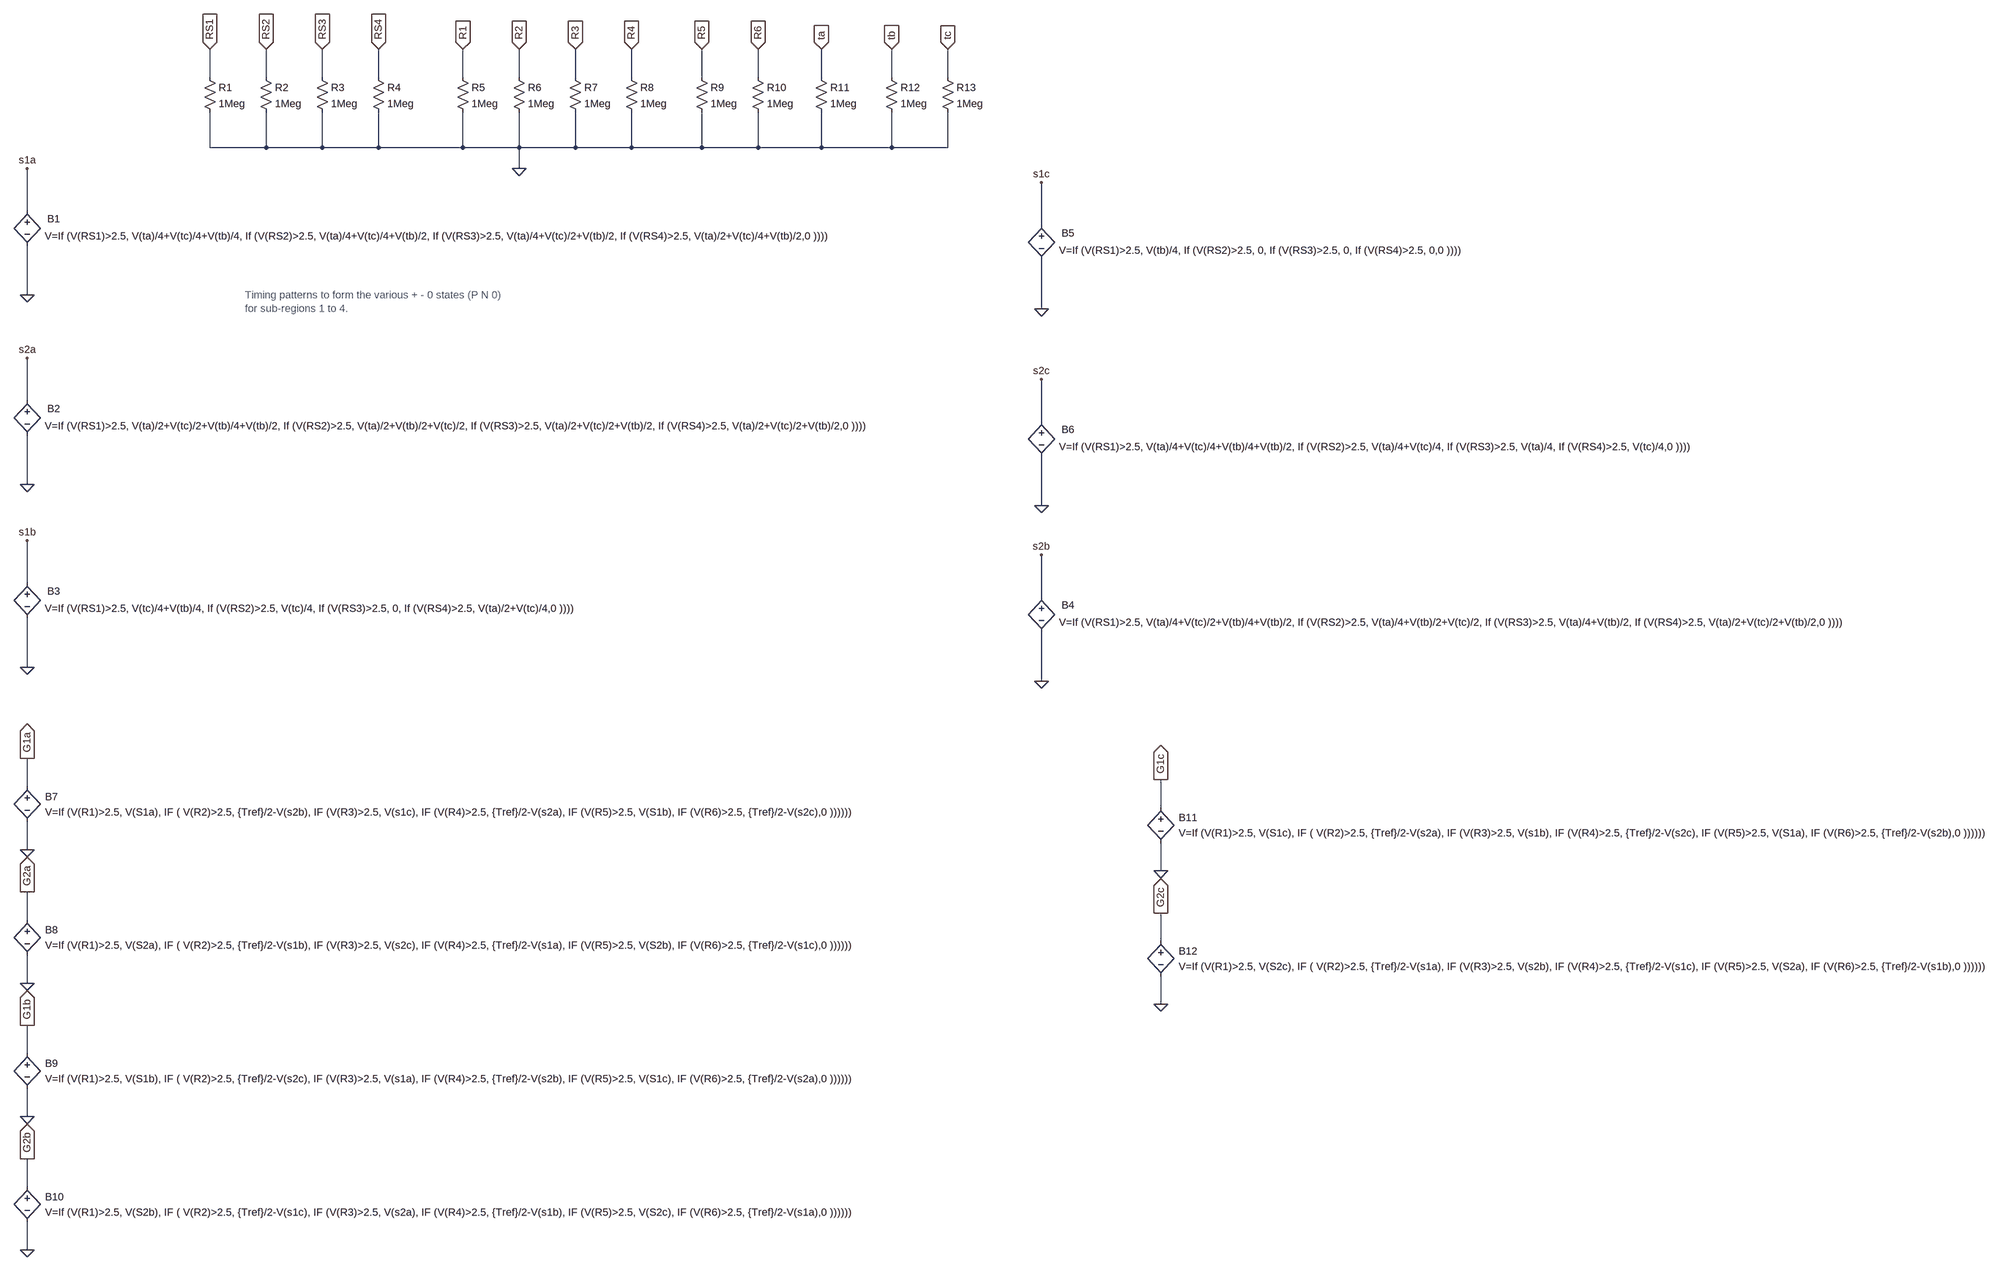
[diagram p0: schematic TimingGenerator.asc]
TimingGenerator.asc, the LTspice schematic file:
Version 4.1
SHEET 1 3956 2836
WIRE -464 -528 -464 -592
WIRE -336 -528 -336 -592
WIRE -208 -528 -208 -592
WIRE -80 -528 -80 -592
WIRE 112 -528 112 -592
WIRE 240 -528 240 -592
WIRE 368 -528 368 -592
WIRE 496 -528 496 -592
WIRE 656 -528 656 -592
WIRE 784 -528 784 -592
WIRE 928 -528 928 -592
WIRE 1088 -528 1088 -592
WIRE 1216 -528 1216 -592
WIRE -464 -368 -464 -448
WIRE -336 -368 -336 -448
WIRE -336 -368 -464 -368
WIRE -208 -368 -208 -448
WIRE -208 -368 -336 -368
WIRE -80 -368 -80 -448
WIRE -80 -368 -208 -368
WIRE 112 -368 112 -448
WIRE 112 -368 -80 -368
WIRE 240 -368 240 -448
WIRE 240 -368 112 -368
WIRE 368 -368 368 -448
WIRE 368 -368 240 -368
WIRE 496 -368 496 -448
WIRE 496 -368 368 -368
WIRE 656 -368 656 -448
WIRE 656 -368 496 -368
WIRE 784 -368 784 -448
WIRE 784 -368 656 -368
WIRE 928 -368 928 -448
WIRE 928 -368 784 -368
WIRE 1088 -368 1088 -448
WIRE 1088 -368 928 -368
WIRE 1216 -368 1216 -448
WIRE 1216 -368 1088 -368
WIRE 240 -320 240 -368
WIRE -880 -224 -880 -320
WIRE 1584 -192 1584 -288
WIRE -880 -32 -880 -144
WIRE 1584 0 1584 -112
WIRE -880 208 -880 112
WIRE 1584 256 1584 160
WIRE -880 400 -880 288
WIRE 1584 448 1584 336
WIRE -880 624 -880 528
WIRE 1584 656 1584 560
WIRE -880 816 -880 704
WIRE 1584 848 1584 736
WIRE -880 1088 -880 1024
WIRE 1856 1136 1856 1072
WIRE -880 1232 -880 1168
WIRE 1856 1280 1856 1216
WIRE -880 1392 -880 1328
WIRE 1856 1440 1856 1376
WIRE -880 1536 -880 1472
WIRE 1856 1584 1856 1520
WIRE -880 1696 -880 1632
WIRE -880 1840 -880 1776
WIRE -880 2000 -880 1936
WIRE -880 2144 -880 2080
FLAG -880 -320 s1a
FLAG -880 -32 0
FLAG -880 112 s2a
FLAG -880 400 0
FLAG -880 528 s1b
FLAG -880 816 0
FLAG 1584 560 s2b
FLAG 1584 848 0
FLAG 1584 -288 s1c
FLAG 1584 0 0
FLAG 1584 160 s2c
FLAG 1584 448 0
FLAG -880 1232 0
FLAG -880 1024 G1a
IOPIN -880 1024 Out
FLAG -880 1536 0
FLAG -880 1328 G2a
IOPIN -880 1328 Out
FLAG -880 1840 0
FLAG -880 1632 G1b
IOPIN -880 1632 Out
FLAG -880 2144 0
FLAG -880 1936 G2b
IOPIN -880 1936 Out
FLAG 1856 1280 0
FLAG 1856 1072 G1c
IOPIN 1856 1072 Out
FLAG 1856 1584 0
FLAG 1856 1376 G2c
IOPIN 1856 1376 Out
FLAG 240 -320 0
FLAG -464 -592 RS1
IOPIN -464 -592 In
FLAG -336 -592 RS2
IOPIN -336 -592 In
FLAG -208 -592 RS3
IOPIN -208 -592 In
FLAG -80 -592 RS4
IOPIN -80 -592 In
FLAG 112 -592 R1
IOPIN 112 -592 In
FLAG 240 -592 R2
IOPIN 240 -592 In
FLAG 368 -592 R3
IOPIN 368 -592 In
FLAG 496 -592 R4
IOPIN 496 -592 In
FLAG 656 -592 R5
IOPIN 656 -592 In
FLAG 784 -592 R6
IOPIN 784 -592 In
FLAG 928 -592 ta
IOPIN 928 -592 In
FLAG 1088 -592 tb
IOPIN 1088 -592 In
FLAG 1216 -592 tc
IOPIN 1216 -592 In
SYMBOL bv -880 -240 R0
WINDOW 0 46 35 Left 2
WINDOW 3 40 74 Left 2
SYMATTR InstName B1
SYMATTR Value V=If (V(RS1)>2.5, V(ta)/4+V(tc)/4+V(tb)/4, If (V(RS2)>2.5, V(ta)/4+V(tc)/4+V(tb)/2, If (V(RS3)>2.5, V(ta)/4+V(tc)/2+V(tb)/2, If (V(RS4)>2.5, V(ta)/2+V(tc)/4+V(tb)/2,0 ))))
SYMBOL bv -880 192 R0
WINDOW 0 46 35 Left 2
WINDOW 3 40 74 Left 2
SYMATTR InstName B2
SYMATTR Value V=If (V(RS1)>2.5, V(ta)/2+V(tc)/2+V(tb)/4+V(tb)/2, If (V(RS2)>2.5, V(ta)/2+V(tb)/2+V(tc)/2, If (V(RS3)>2.5, V(ta)/2+V(tc)/2+V(tb)/2, If (V(RS4)>2.5, V(ta)/2+V(tc)/2+V(tb)/2,0 ))))
SYMBOL bv -880 608 R0
WINDOW 0 46 35 Left 2
WINDOW 3 40 74 Left 2
SYMATTR InstName B3
SYMATTR Value V=If (V(RS1)>2.5, V(tc)/4+V(tb)/4, If (V(RS2)>2.5, V(tc)/4, If (V(RS3)>2.5, 0, If (V(RS4)>2.5, V(ta)/2+V(tc)/4,0 ))))
SYMBOL bv 1584 640 R0
WINDOW 0 46 35 Left 2
WINDOW 3 40 74 Left 2
SYMATTR InstName B4
SYMATTR Value V=If (V(RS1)>2.5, V(ta)/4+V(tc)/2+V(tb)/4+V(tb)/2, If (V(RS2)>2.5, V(ta)/4+V(tb)/2+V(tc)/2, If (V(RS3)>2.5, V(ta)/4+V(tb)/2, If (V(RS4)>2.5, V(ta)/2+V(tc)/2+V(tb)/2,0 ))))
SYMBOL bv 1584 -208 R0
WINDOW 0 46 35 Left 2
WINDOW 3 40 74 Left 2
SYMATTR InstName B5
SYMATTR Value V=If (V(RS1)>2.5, V(tb)/4, If (V(RS2)>2.5, 0, If (V(RS3)>2.5, 0, If (V(RS4)>2.5, 0,0 ))))
SYMBOL bv 1584 240 R0
WINDOW 0 46 35 Left 2
WINDOW 3 40 74 Left 2
SYMATTR InstName B6
SYMATTR Value V=If (V(RS1)>2.5, V(ta)/4+V(tc)/4+V(tb)/4+V(tb)/2, If (V(RS2)>2.5, V(ta)/4+V(tc)/4, If (V(RS3)>2.5, V(ta)/4, If (V(RS4)>2.5, V(tc)/4,0 ))))
SYMBOL bv -880 1072 R0
WINDOW 0 41 39 Left 2
WINDOW 3 41 74 Left 2
SYMATTR InstName B7
SYMATTR Value V=If (V(R1)>2.5, V(S1a), IF ( V(R2)>2.5, {Tref}/2-V(s2b), IF (V(R3)>2.5, V(s1c), IF (V(R4)>2.5, {Tref}/2-V(s2a), IF (V(R5)>2.5, V(S1b), IF (V(R6)>2.5, {Tref}/2-V(s2c),0 ))))))
SYMBOL bv -880 1376 R0
WINDOW 0 41 39 Left 2
WINDOW 3 41 74 Left 2
SYMATTR InstName B8
SYMATTR Value V=If (V(R1)>2.5, V(S2a), IF ( V(R2)>2.5, {Tref}/2-V(s1b), IF (V(R3)>2.5, V(s2c), IF (V(R4)>2.5, {Tref}/2-V(s1a), IF (V(R5)>2.5, V(S2b), IF (V(R6)>2.5, {Tref}/2-V(s1c),0 ))))))
SYMBOL bv -880 1680 R0
WINDOW 0 41 39 Left 2
WINDOW 3 41 74 Left 2
SYMATTR InstName B9
SYMATTR Value V=If (V(R1)>2.5, V(S1b), IF ( V(R2)>2.5, {Tref}/2-V(s2c), IF (V(R3)>2.5, V(s1a), IF (V(R4)>2.5, {Tref}/2-V(s2b), IF (V(R5)>2.5, V(S1c), IF (V(R6)>2.5, {Tref}/2-V(s2a),0 ))))))
SYMBOL bv -880 1984 R0
WINDOW 0 41 39 Left 2
WINDOW 3 41 74 Left 2
SYMATTR InstName B10
SYMATTR Value V=If (V(R1)>2.5, V(S2b), IF ( V(R2)>2.5, {Tref}/2-V(s1c), IF (V(R3)>2.5, V(s2a), IF (V(R4)>2.5, {Tref}/2-V(s1b), IF (V(R5)>2.5, V(S2c), IF (V(R6)>2.5, {Tref}/2-V(s1a),0 ))))))
SYMBOL bv 1856 1120 R0
WINDOW 0 41 39 Left 2
WINDOW 3 41 74 Left 2
SYMATTR InstName B11
SYMATTR Value V=If (V(R1)>2.5, V(S1c), IF ( V(R2)>2.5, {Tref}/2-V(s2a), IF (V(R3)>2.5, V(s1b), IF (V(R4)>2.5, {Tref}/2-V(s2c), IF (V(R5)>2.5, V(S1a), IF (V(R6)>2.5, {Tref}/2-V(s2b),0 ))))))
SYMBOL bv 1856 1424 R0
WINDOW 0 41 39 Left 2
WINDOW 3 41 74 Left 2
SYMATTR InstName B12
SYMATTR Value V=If (V(R1)>2.5, V(S2c), IF ( V(R2)>2.5, {Tref}/2-V(s1a), IF (V(R3)>2.5, V(s2b), IF (V(R4)>2.5, {Tref}/2-V(s1c), IF (V(R5)>2.5, V(S2a), IF (V(R6)>2.5, {Tref}/2-V(s1b),0 ))))))
SYMBOL res -480 -544 R0
SYMATTR InstName R1
SYMATTR Value 1Meg
SYMBOL res -352 -544 R0
SYMATTR InstName R2
SYMATTR Value 1Meg
SYMBOL res -224 -544 R0
SYMATTR InstName R3
SYMATTR Value 1Meg
SYMBOL res -96 -544 R0
SYMATTR InstName R4
SYMATTR Value 1Meg
SYMBOL res 96 -544 R0
SYMATTR InstName R5
SYMATTR Value 1Meg
SYMBOL res 224 -544 R0
SYMATTR InstName R6
SYMATTR Value 1Meg
SYMBOL res 352 -544 R0
SYMATTR InstName R7
SYMATTR Value 1Meg
SYMBOL res 480 -544 R0
SYMATTR InstName R8
SYMATTR Value 1Meg
SYMBOL res 640 -544 R0
SYMATTR InstName R9
SYMATTR Value 1Meg
SYMBOL res 768 -544 R0
SYMATTR InstName R10
SYMATTR Value 1Meg
SYMBOL res 912 -544 R0
SYMATTR InstName R11
SYMATTR Value 1Meg
SYMBOL res 1072 -544 R0
SYMATTR InstName R12
SYMATTR Value 1Meg
SYMBOL res 1200 -544 R0
SYMATTR InstName R13
SYMATTR Value 1Meg
TEXT -384 -32 Left 2 ;Timing patterns to form the various + - 0 states (P N 0)\nfor sub-regions 1 to 4.

The netlist it stands for:
* TimingGenerator.asc
B1 s1a 0 V=If (V(RS1)>2.5, V(ta)/4+V(tc)/4+V(tb)/4, If (V(RS2)>2.5, V(ta)/4+V(tc)/4+V(tb)/2, If (V(RS3)>2.5, V(ta)/4+V(tc)/2+V(tb)/2, If (V(RS4)>2.5, V(ta)/2+V(tc)/4+V(tb)/2,0 ))))
B2 s2a 0 V=If (V(RS1)>2.5, V(ta)/2+V(tc)/2+V(tb)/4+V(tb)/2, If (V(RS2)>2.5, V(ta)/2+V(tb)/2+V(tc)/2, If (V(RS3)>2.5, V(ta)/2+V(tc)/2+V(tb)/2, If (V(RS4)>2.5, V(ta)/2+V(tc)/2+V(tb)/2,0 ))))
B3 s1b 0 V=If (V(RS1)>2.5, V(tc)/4+V(tb)/4, If (V(RS2)>2.5, V(tc)/4, If (V(RS3)>2.5, 0, If (V(RS4)>2.5, V(ta)/2+V(tc)/4,0 ))))
B4 s2b 0 V=If (V(RS1)>2.5, V(ta)/4+V(tc)/2+V(tb)/4+V(tb)/2, If (V(RS2)>2.5, V(ta)/4+V(tb)/2+V(tc)/2, If (V(RS3)>2.5, V(ta)/4+V(tb)/2, If (V(RS4)>2.5, V(ta)/2+V(tc)/2+V(tb)/2,0 ))))
B5 s1c 0 V=If (V(RS1)>2.5, V(tb)/4, If (V(RS2)>2.5, 0, If (V(RS3)>2.5, 0, If (V(RS4)>2.5, 0,0 ))))
B6 s2c 0 V=If (V(RS1)>2.5, V(ta)/4+V(tc)/4+V(tb)/4+V(tb)/2, If (V(RS2)>2.5, V(ta)/4+V(tc)/4, If (V(RS3)>2.5, V(ta)/4, If (V(RS4)>2.5, V(tc)/4,0 ))))
B7 G1a 0 V=If (V(R1)>2.5, V(S1a), IF ( V(R2)>2.5, {Tref}/2-V(s2b), IF (V(R3)>2.5, V(s1c), IF (V(R4)>2.5, {Tref}/2-V(s2a), IF (V(R5)>2.5, V(S1b), IF (V(R6)>2.5, {Tref}/2-V(s2c),0 ))))))
B8 G2a 0 V=If (V(R1)>2.5, V(S2a), IF ( V(R2)>2.5, {Tref}/2-V(s1b), IF (V(R3)>2.5, V(s2c), IF (V(R4)>2.5, {Tref}/2-V(s1a), IF (V(R5)>2.5, V(S2b), IF (V(R6)>2.5, {Tref}/2-V(s1c),0 ))))))
B9 G1b 0 V=If (V(R1)>2.5, V(S1b), IF ( V(R2)>2.5, {Tref}/2-V(s2c), IF (V(R3)>2.5, V(s1a), IF (V(R4)>2.5, {Tref}/2-V(s2b), IF (V(R5)>2.5, V(S1c), IF (V(R6)>2.5, {Tref}/2-V(s2a),0 ))))))
B10 G2b 0 V=If (V(R1)>2.5, V(S2b), IF ( V(R2)>2.5, {Tref}/2-V(s1c), IF (V(R3)>2.5, V(s2a), IF (V(R4)>2.5, {Tref}/2-V(s1b), IF (V(R5)>2.5, V(S2c), IF (V(R6)>2.5, {Tref}/2-V(s1a),0 ))))))
B11 G1c 0 V=If (V(R1)>2.5, V(S1c), IF ( V(R2)>2.5, {Tref}/2-V(s2a), IF (V(R3)>2.5, V(s1b), IF (V(R4)>2.5, {Tref}/2-V(s2c), IF (V(R5)>2.5, V(S1a), IF (V(R6)>2.5, {Tref}/2-V(s2b),0 ))))))
B12 G2c 0 V=If (V(R1)>2.5, V(S2c), IF ( V(R2)>2.5, {Tref}/2-V(s1a), IF (V(R3)>2.5, V(s2b), IF (V(R4)>2.5, {Tref}/2-V(s1c), IF (V(R5)>2.5, V(S2a), IF (V(R6)>2.5, {Tref}/2-V(s1b),0 ))))))
R1 RS1 0 1Meg
R2 RS2 0 1Meg
R3 RS3 0 1Meg
R4 RS4 0 1Meg
R5 R1 0 1Meg
R6 R2 0 1Meg
R7 R3 0 1Meg
R8 R4 0 1Meg
R9 R5 0 1Meg
R10 R6 0 1Meg
R11 ta 0 1Meg
R12 tb 0 1Meg
R13 tc 0 1Meg
* Timing patterns to form the various + - 0 states (P N 0)
* for sub-regions 1 to 4.
.backanno
.end